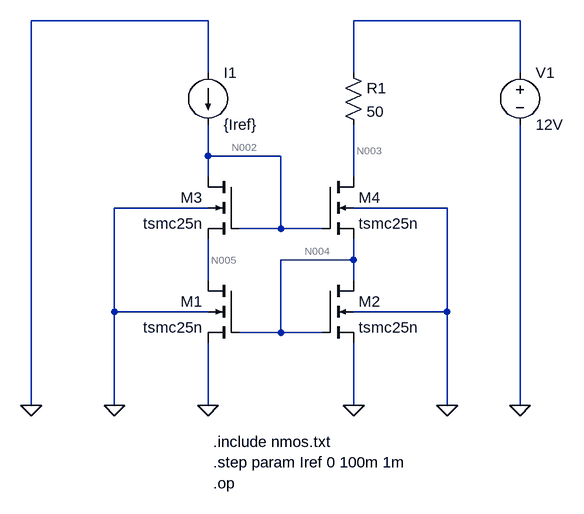
[diagram p0: schematic HW1_SIM_2.asc]
HW1_SIM_2.asc, the LTspice schematic file:
Version 4
SHEET 1 880 680
WIRE 80 -336 -192 -336
WIRE 560 -336 304 -336
WIRE 80 -256 80 -336
WIRE 304 -256 304 -336
WIRE 560 -256 560 -336
WIRE 80 -128 80 -176
WIRE 192 -128 80 -128
WIRE 80 -96 80 -128
WIRE 304 -96 304 -176
WIRE 80 -48 -64 -48
WIRE 448 -48 304 -48
WIRE 192 -16 192 -128
WIRE 192 -16 128 -16
WIRE 256 -16 192 -16
WIRE 304 32 304 0
WIRE 304 32 192 32
WIRE 80 64 80 0
WIRE 304 64 304 32
WIRE -64 112 -64 -48
WIRE 80 112 -64 112
WIRE 448 112 448 -48
WIRE 448 112 304 112
WIRE 192 144 192 32
WIRE 192 144 128 144
WIRE 256 144 192 144
WIRE -192 256 -192 -336
WIRE -64 256 -64 112
WIRE 80 256 80 160
WIRE 304 256 304 160
WIRE 448 256 448 112
WIRE 560 256 560 -176
FLAG 80 256 0
FLAG 304 256 0
FLAG -64 256 0
FLAG 448 256 0
FLAG 560 256 0
FLAG -192 256 0
SYMBOL nmos4 128 64 M0
SYMATTR InstName M1
SYMATTR Value tsmc25n
SYMATTR Value2 l=0.18 w=20
SYMBOL nmos4 256 64 R0
SYMATTR InstName M2
SYMATTR Value tsmc25n
SYMATTR Value2 l=0.18 w=20
SYMBOL nmos4 128 -96 M0
SYMATTR InstName M3
SYMATTR Value tsmc25n
SYMATTR Value2 l=0.18 w=20
SYMBOL nmos4 256 -96 R0
SYMATTR InstName M4
SYMATTR Value tsmc25n
SYMATTR Value2 l=0.18 w=20
SYMBOL res 288 -272 R0
SYMATTR InstName R1
SYMATTR Value 50
SYMBOL voltage 560 -272 R0
WINDOW 123 0 0 Left 0
WINDOW 39 0 0 Left 0
SYMATTR InstName V1
SYMATTR Value 12V
SYMBOL current 80 -256 R0
WINDOW 123 0 0 Left 0
WINDOW 39 0 0 Left 0
SYMATTR InstName I1
SYMATTR Value {Iref}
TEXT 88 312 Left 2 !.include nmos.txt
TEXT 88 376 Left 2 !.op
TEXT 88 344 Left 2 !.step param Iref 0 100m 1m

The netlist it stands for:
* HW1_SIM_2.asc
M1 N005 N004 0 0 tsmc25n l=0.18 w=20
M2 N004 N004 0 0 tsmc25n l=0.18 w=20
M3 N002 N002 N005 0 tsmc25n l=0.18 w=20
M4 N003 N002 N004 0 tsmc25n l=0.18 w=20
R1 N001 N003 50
V1 N001 0 12V
I1 0 N002 {Iref}
.model NMOS NMOS
.model PMOS PMOS
.lib standard.mos
.include nmos.txt
.op
.step param Iref 0 100m 1m
.backanno
.end

* Results of the author's LTspice run, read from the files saved beside the schematic
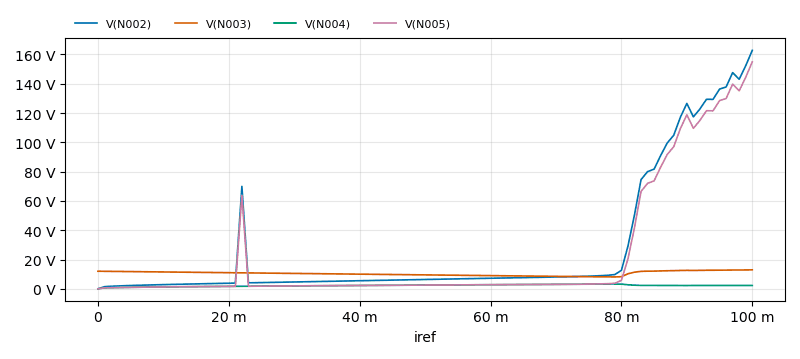
[diagram p1: Operating Point of HW1_SIM_2.asc, plotted from the saved traces]
* Operating Point, 1 run:
*   V(N002): -0.009975 fV at iref=0, 162.8 V at iref=100 m, min -0.009975 fV, max 162.8 V
*   V(N003): 12 V at iref=0, 12.94 V at iref=100 m, min 8.104 V, max 12.94 V
*   V(N004): 11.95 mV at iref=0, 2.283 V at iref=100 m, min 11.95 mV, max 3.233 V
*   V(N005): -0.00182 fV at iref=0, 154.9 V at iref=100 m, min -0.00182 fV, max 154.9 V
* From the log:
*   Semiconductor Device Operating Points:
*                           --- BSIM3 MOSFETS ---
*   Name:        m4          m3          m2          m1
*   Model:     tsmc25n     tsmc25n     tsmc25n     tsmc25n
*   Id:        7.33e-10   -4.93e-25    7.21e-10   -1.82e-30
*   Vgs:      -1.20e-02   -8.15e-18    1.20e-02    1.20e-02
*   Vds:       1.20e+01   -8.15e-18    1.20e-02   -1.82e-18
*   Vbs:      -1.20e-02    1.82e-18    0.00e+00    0.00e+00
*   Vth:       3.70e-01    3.66e-01    3.66e-01    3.66e-01
*   Vdsat:     3.19e-02    3.18e-02    3.18e-02    3.18e-02
*   Gm:        2.01e-08    1.37e-23    2.01e-08    9.63e-28
*   Gds:       8.57e-16    5.40e-08    4.62e-08    7.54e-08
*   Gmb        6.98e-09    4.88e-24    7.01e-09   -8.56e-26
*   Cbd:       0.00e+00    0.00e+00    0.00e+00    0.00e+00
*   Cbs:       0.00e+00    0.00e+00    0.00e+00    0.00e+00
*   Cgsov:     1.61e-08    1.61e-08    1.61e-08    1.61e-08
*   Cgdov:     1.61e-08    1.61e-08    1.61e-08    1.61e-08
*   Cgbov:     1.80e-13    1.80e-13    1.80e-13    1.80e-13
*   dQgdVgb:   8.87e-03    8.87e-03    8.82e-03    8.82e-03
*   dQgdVdb:  -1.61e-08   -6.22e-07   -2.91e-07   -8.62e-07
*   dQgdVsb:  -8.14e-07   -8.13e-07   -1.36e-06   -1.01e-06
*   dQddVgb:  -2.48e-07   -5.67e-07   -6.53e-07   -7.86e-07
*   dQddVdb:   1.61e-08    5.09e-07    2.40e-07    7.04e-07
*   dQddVsb:   3.20e-07    2.69e-07    6.55e-07    3.74e-07
*   dQbdVgb:  -8.87e-03   -8.87e-03   -8.82e-03   -8.82e-03
*   dQbdVdb:  -2.92e-15   -3.79e-07   -1.72e-07   -5.30e-07
*   dQbdVsb:   1.58e-07    2.60e-07    3.30e-08    2.48e-07